# EAGLE schematic DISCHARGE (EAGLE 9.6.1)
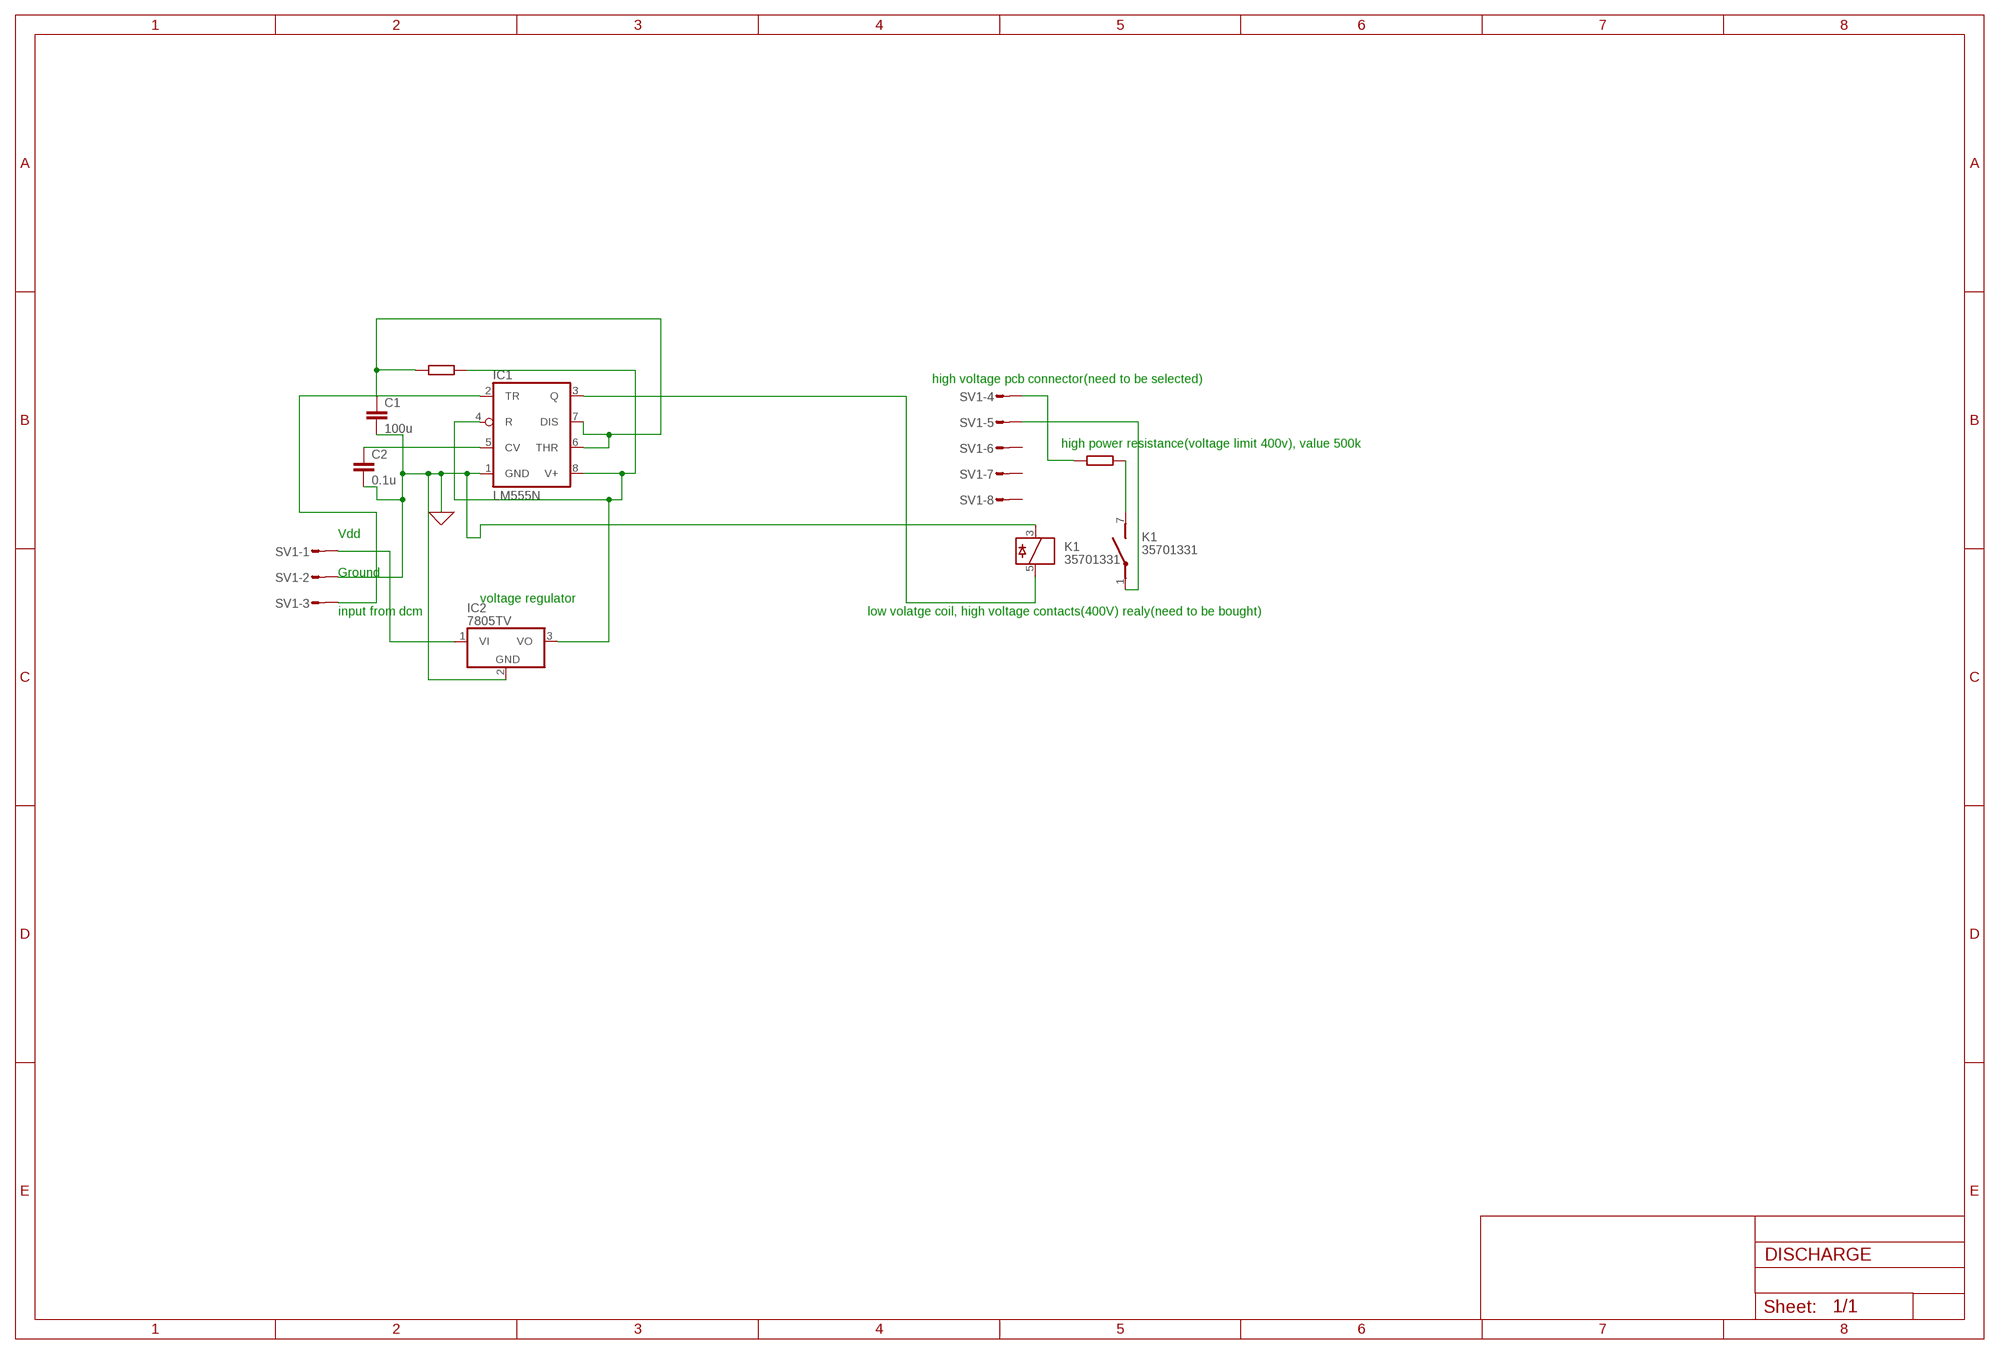
[diagram p0: schematic, sheet 1]

## Parts
C1  100u  C2,5-3  [C2.5-3]
C2  0.1u  C2,5-3  [C2.5-3]
IC1  LM555N  [DIL08]
IC2  7805TV  [TO220V]
K1  35701331  [REED]
SV1  MT6-8  [MT6-8]

## Nets
0: C1.2 C2.2 IC1.1(GND) IC2.2(GND) K1.3 SV1.2 ; supply symbol labelled GND
N$1: C2.1 IC1.5(CV)
N$2: C1.1 IC1.6(THR) IC1.7(DIS)
N$3: IC1.4(R) IC1.8(V+) IC2.3(VO)
N$4: IC2.1(VI) SV1.1
N$5: IC1.2(TR) SV1.3
N$6: IC1.3(Q) K1.5
N$7: K1.7(2:S)
N$8: SV1.4
N$10: K1.1(2:P) SV1.5
Unconnected: SV1.6 SV1.7 SV1.8

## Notes on the sheet
- high voltage pcb connector(need to be selected)
- high power resistance(voltage limit 400v), value 500k
- Vdd
- Ground
- voltage regulator
- input from dcm | low volatge coil, high voltage contacts(400V) realy(need to be bought)

## Library data of the parts
C1 C2 = capacitor-wima:C: CAPACITOR naming: grid - package width
IC1 = linear:*555: TIMER
IC2 = linear:78*: Positive VOLTAGE REGULATOR Source: http://cache.national.com/ds/LM/LM78L05.pdf http://www.fairchildsemi.com/ds/LM/LM7805.pdf
K1 = relay:35701331: RELAY reed, 1 x norm. open with polarity; OC_FARNELL: unknown; OC_NEWARK: unknown
SV1 = con-amp-mt6:MT6-8: AMP MT6 CONNECTOR; OC_FARNELL: unknown; OC_NEWARK: unknown